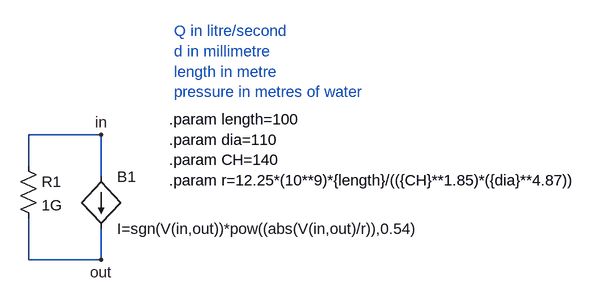
[diagram p0: schematic Pipe.asc]
Pipe.asc, the LTspice schematic file:
Version 4
SHEET 1 1436 680
WIRE 192 80 80 80
WIRE 80 128 80 80
WIRE 192 144 192 80
WIRE 80 272 80 208
WIRE 192 272 192 224
WIRE 192 272 80 272
FLAG 192 80 in
FLAG 192 272 out
SYMBOL res 64 112 R0
SYMATTR InstName R1
SYMATTR Value 1G
SYMBOL bi 192 144 R0
SYMATTR InstName B1
SYMATTR Value I=sgn(V(in,out))*pow((abs(V(in,out)/r)),0.54)
TEXT 304 -80 Left 2 ;Q in litre/second\nd in millimetre\nlength in metre\npressure in metres of water
TEXT 296 56 Left 2 !.param length=100\n.param dia=110\n.param CH=140\n.param r=12.25*(10**9)*{length}/(({CH}**1.85)*({dia}**4.87))

The netlist it stands for:
* Pipe.asc
R1 in out 1G
B1 in out I=sgn(V(in,out))*pow((abs(V(in,out)/r)),0.54)
* Q in litre/second
* d in millimetre
* length in metre
* pressure in metres of water
.param length=100
.param dia=110
.param CH=140
.param r=12.25*(10**9)*{length}/(({CH}**1.85)*({dia}**4.87))
.backanno
.end